# Altium schematic sheet Communication.SchDoc
size A4; SheetNumber: 7; SheetTotal: 8
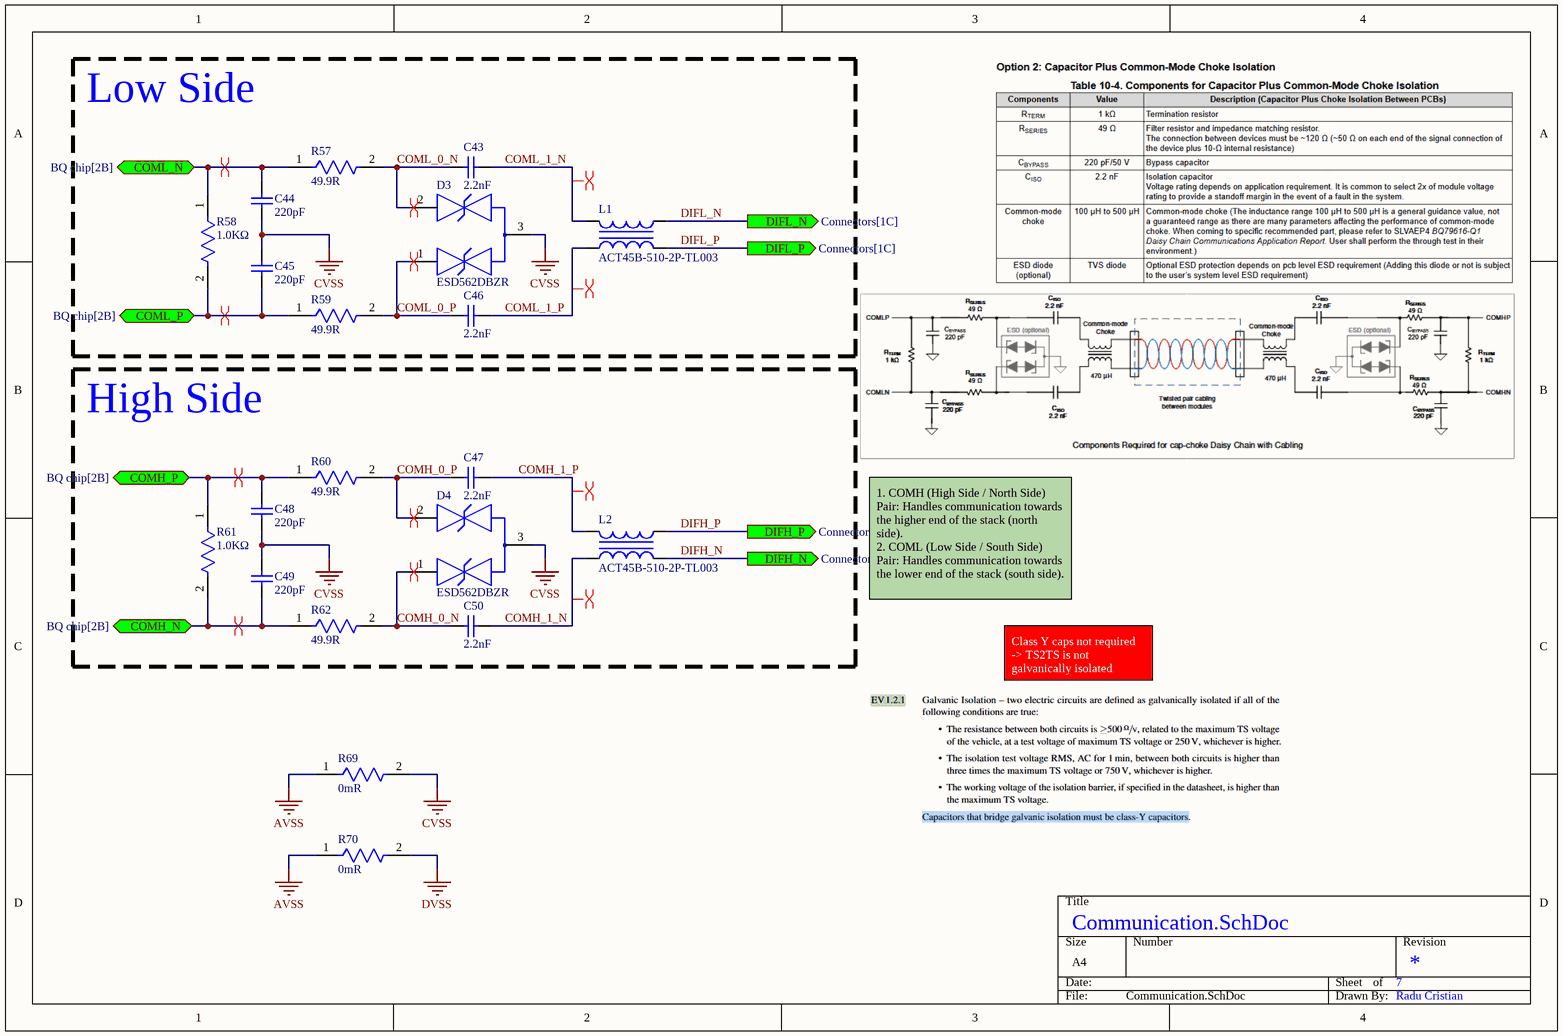
[diagram p0: Communication.SchDoc]

## Parts
C43  Parameter 1: 2.2nF  [CAPC1608X92X38ML15T08]  (hidden comment: VJ0603Y222JXBAC)
C44  value 220pF  [CAPC0603(1608)100_N]  (hidden comment: CAP 220pF 100V 0603(1608))
C45  value 220pF  [CAPC0603(1608)100_N]  (hidden comment: CAP 220pF 100V 0603(1608))
C46  Parameter 1: 2.2nF  [CAPC1608X92X38ML15T08]  (hidden comment: VJ0603Y222JXBAC)
C47  Parameter 1: 2.2nF  [CAPC1608X92X38ML15T08]  (hidden comment: VJ0603Y222JXBAC)
C48  value 220pF  [CAPC0603(1608)100_N]  (hidden comment: CAP 220pF 100V 0603(1608))
C49  value 220pF  [CAPC0603(1608)100_N]  (hidden comment: CAP 220pF 100V 0603(1608))
C50  Parameter 1: 2.2nF  [CAPC1608X92X38ML15T08]  (hidden comment: VJ0603Y222JXBAC)
D3  ESD562DBZR  [FP-DBZ0003A-MFG]
D4  ESD562DBZR  [FP-DBZ0003A-MFG]
L1  ACT45B-510-2P-TL003  [TDK-ACT45B-510-2P-TL003-4_V]
L2  ACT45B-510-2P-TL003  [TDK-ACT45B-510-2P-TL003-4_V]
R57  Resistance: 49.9R  [FP-CRCW0603-HPe3-MFG]  (hidden comment: CRCW060349R9FKECHP)
R58  Resistance: 1.0KΩ  [FP-CPF0603-MFG]  (hidden comment: CPF0603F1K0C1)
R59  Resistance: 49.9R  [FP-CRCW0603-HPe3-MFG]  (hidden comment: CRCW060349R9FKECHP)
R60  Resistance: 49.9R  [FP-CRCW0603-HPe3-MFG]  (hidden comment: CRCW060349R9FKECHP)
R61  Resistance: 1.0KΩ  [FP-CPF0603-MFG]  (hidden comment: CPF0603F1K0C1)
R62  Resistance: 49.9R  [FP-CRCW0603-HPe3-MFG]  (hidden comment: CRCW060349R9FKECHP)
R69  Resistance: 0mR  [FP-MCT0603-MFG]  (hidden comment: MCT06030Z0000ZPW00)
R70  Resistance: 0mR  [FP-MCT0603-MFG]  (hidden comment: MCT06030Z0000ZPW00)

## Blocks framed on the sheet
Low Side: C43-C46 D3 L1 R57-R59
High Side: C47-C50 D4 L2 R60-R62

## Ports
COMH_N (bidir, see BQ chip[2B]), COMH_P (bidir, see BQ chip[2B]), COML_N (bidir, see BQ chip[2B]), COML_P (bidir, see BQ chip[2B]), DIFH_N (out, see Connectors[2C]), DIFH_P (out, see Connectors[2C]), DIFL_N (out, see Connectors[1C]), DIFL_P (out, see Connectors[1C])

## Nets
AVSS: R69.1 R70.1
CVSS: C44.2 C45.1 C48.2 C49.1 D3.3(GND) D4.3(GND) R69.2
DVSS: R70.2
COMH_0_N: C50.2 D4.1(1_IO) R62.2
COMH_0_P: C47.2 D4.2(2_IO) R60.2
COMH_1_N: C50.1 L2.2
COMH_1_P: C47.1 L2.1
COMH_N: C49.2 R61.2 R62.1 ; port COMH_N
COMH_P: C48.1 R60.1 R61.1 ; port COMH_P
COML_0_N: C43.2 D3.2(2_IO) R57.2
COML_0_P: C46.2 D3.1(1_IO) R59.2
COML_1_N: C43.1 L1.1
COML_1_P: C46.1 L1.2
COML_N: C44.1 R57.1 R58.1 ; port COML_N
COML_P: C45.2 R58.2 R59.1 ; port COML_P
DIFH_N: L2.3 ; port DIFH_N
DIFH_P: L2.4 ; port DIFH_P
DIFL_N: L1.4 ; port DIFL_N
DIFL_P: L1.3 ; port DIFL_P

## Layout directives
differential pair: COMH_0_N, COMH_0_P, COMH_1_N, COMH_1_P, COMH_N, COMH_P, COML_0_N, COML_0_P, COML_1_N, COML_1_P, COML_N, COML_P

## Notes on the sheet
- 1. COMH (High Side / North Side) Pair: Handles communication towards the higher end of the stack (north side).
  2. COML (Low Side / South Side) Pair: Handles communication towards the lower end of the stack (south side).
- Class Y caps not required -> TS2TS is not galvanically isolated
- Radu Cristian

## Library data of the parts
C43 C46 C47 C50 = CMP-2006-01264-1: Manufacturer: Vitramon; Part Number: VJ0603Y222JXBAC
C44 C45 C48 C49 = CMP-1035-01477-1: CAP 220pF 100V ±10% 0603 (1608 Metric) Thickness 1mm SMD; Tolerance: Â±10%; Case-EIA: 0603; Case-Metric: 1608; Rated Voltage: 100 V; Max Thickness: 1 mm; Technology: SMT
D3 D4 = CMP-00370-147404550-1: ESD562DBZR Two-channel bidirectional 12V ESD protection diode 3-SOT-23 -40 to 125; Manufacturer Lifecycle Status: ACTIVE; NexarPartId: 147404550; Thickness: 1mm; Length: 2.92mm; Number of Pins: 3; Height: 1.22mm; Lifecycle Status: Production; Width: 1.3mm; Case/Package: SOT-23
L1 L2 = CMP-2000-05391-1: Common-Mode Choke for CAN Bus System, 51uH, 50 V DC, -40 to 150 degC, 4-Pin SMD, RoHS, Tape and Reel; Manufacturer: TDK; Number of Lines: 2; Impedance: 2.8kOhm; Current: 200mA; Featured Product: FerriteChipCommon-ModeFilterforCAN-BUSSystem; Inductance: 51µH; Other Names: 445-3958-6; Filter Type: Data,SignalLine; DC Resistance (DCR): 1OhmMax; Dynamic Catalog: ACTSeries; Other Drawings: ACM3225SeriesSchematic / ACT45B-xxx-2P_Footprint; Catalog Drawings: (ACM4532,ACT45B)-xxx-2P_Top / ACT45B-xxx-2P_Side / ACT45B-xxx-2P_Bottom; Package / Case: Horizontal,4PCPad; Family: CommonModeChokes; Datasheet Version: Aug-12; Height (Max): 0.118"(3.00mm); Packaging: Digi-Reel; Category: Filters; Datasheet URL: https://datasheet.ciiva.com/22726/1649098-22726290.pdf; Mounting Type: SurfaceMount; Operating Temperature: -40degC~150degC; Size / Dimension: 0.177"Lx0.126"W(4.50mmx3.20mm); Series: ACT; Manufacturer URL: http://www.tdk.com/; Standard Package: 1
R57 R59 R60 R62 = CMP-02407-009504-1: RES Thick Film, 49.9Ω, 1%, 0.33W, 100ppm/°C, 0603; Power Rating: 100mW; Tolerance: 1%; Case/Package: 0603; Lead Free: Lead Free
R58 R61 = CMP-03211-002621-1: RES SMD 1.0KΩ 1% 1/16W 0603; Manufacturer: TE Connectivity; Power Rating: 0.063W; Voltage Rating: 50V; Temperature Coefficient: 50ppm/°C; Octopart: https://octopart.com/cpf0603f1k0c1-te+connectivity-42013134; packaging: 1k Reel; Category: Res; Device Class L3: Chip SMD Resistors; octopart_url: https://octopart.com/cpf0603f1k0c1-te+connectivity-42013134; Value: 1.0KΩ; Temperature: -55°C to +155°C; Composition: Thin Film; ComponentLink2URL: https://www.te.com/commerce/DocumentDelivery/DDEController?Action=showdoc&DocId=Data+Sheet%7F1773200%7FM%7Fpdf%7FEnglish%7FENG_DS_1773200_M.pdf%7F3-1676481-2; Tolerance: 1%; Automotive: No; Lead Free: Yes; Height: 0.55mm; Device Class L1: Passive Components; Device Class L2: Resistors; Ipc Land Pattern Name: RESC15580X45; Series: CPF; ComponentLink2Description: Datasheet; RoHS: TRUE; Package: CPF0603; Manufacturer Part Number: CPF0603F1K0C1; Temperature Range Low: -55°C; Temperature Range High: +155°C
R69 R70 = CMP-02407-001569-1: RES SMD 100 OHM 1% 1/8W 0603; Power Rating: 100mW; Contact Plating: Tin; Termination: Wraparound; Military Standard: Not; Composition: Thin Film; Min Operating Temperature: -55°C; Depth: 0.85mm; Max Operating Temperature: 125°C; Number of Terminations: 2; Case/Package: 0603; Height: 0.022inch; Width: 0.033inch; Lead Free: Lead Free; Length: 1.55mm; Mount: Surface Mount; Packaging: Tape and Reel; Max Power Dissipation: 100mW